# EAGLE design Sensirion_connector_board_v002 (EAGLE 9.6.2)
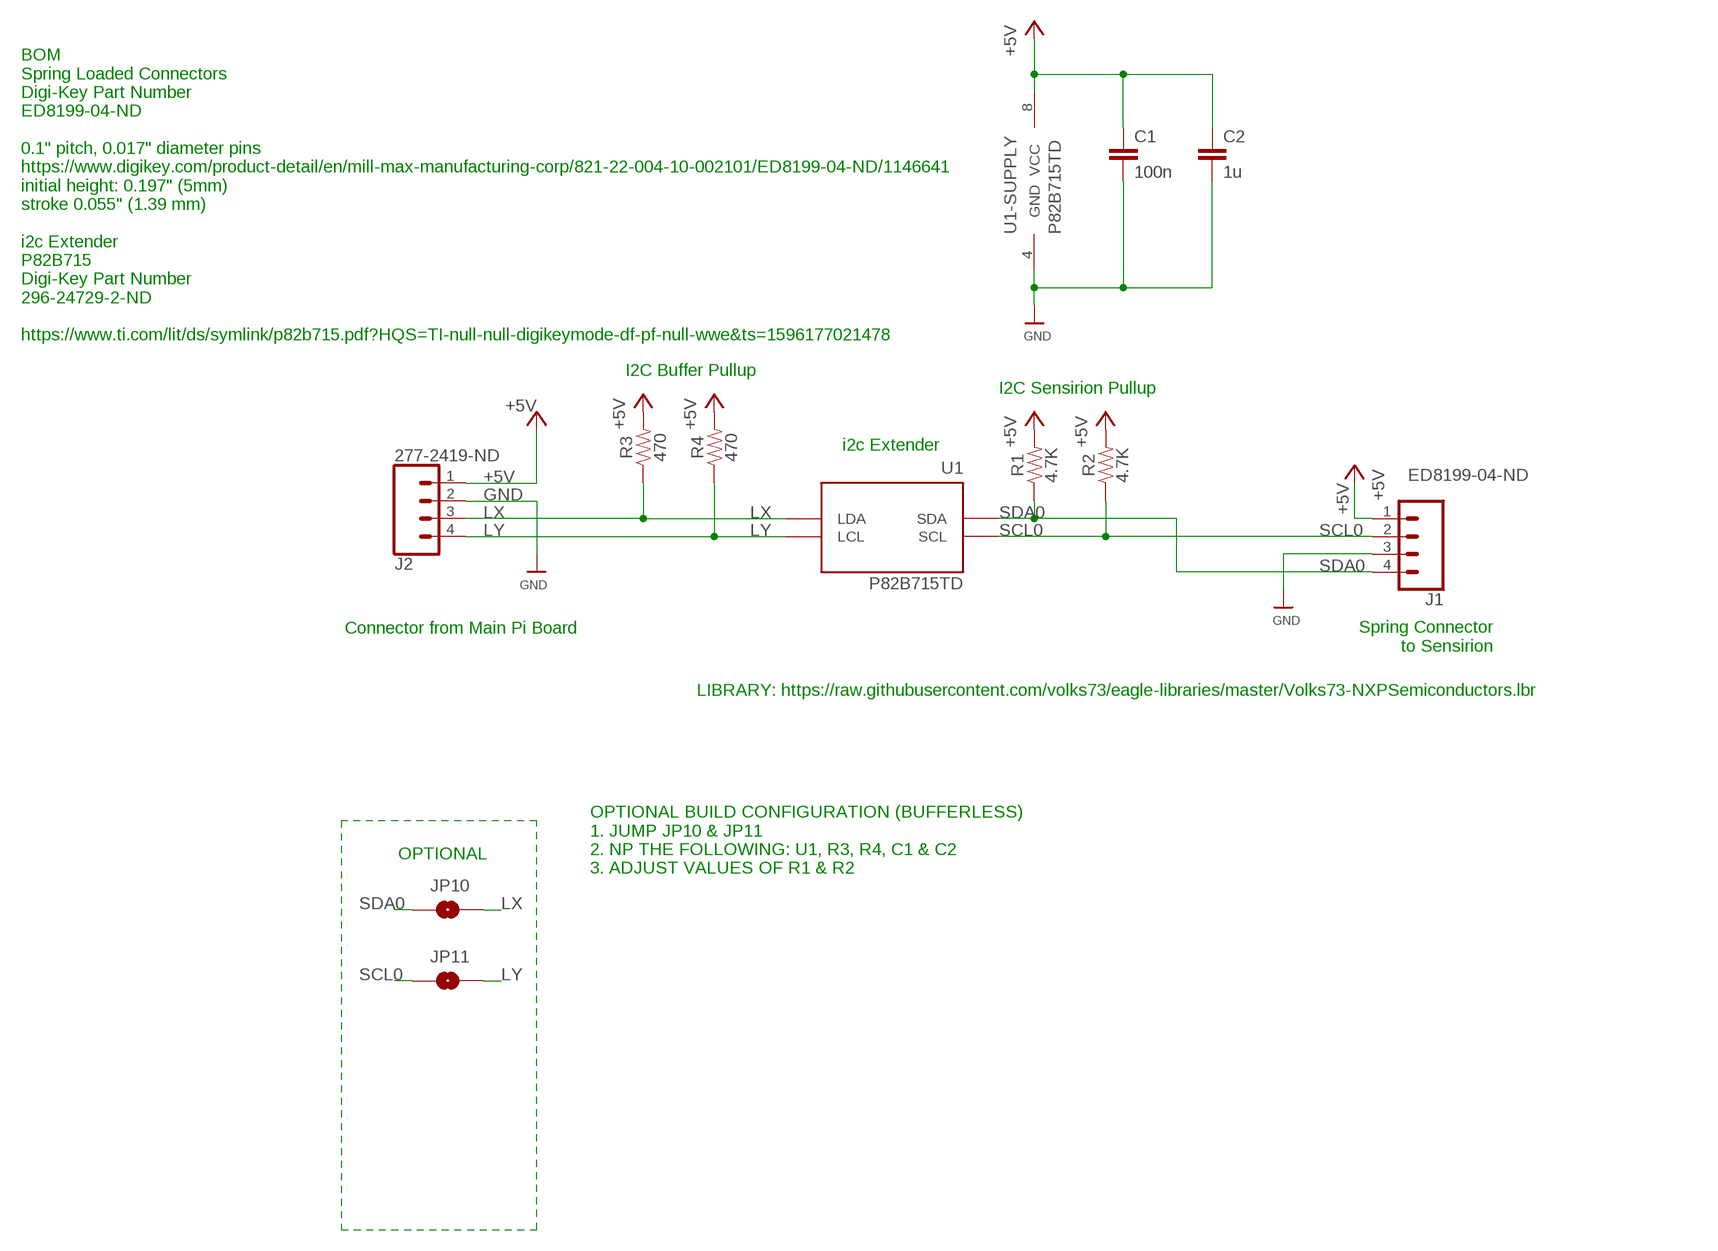
[diagram p0: schematic, sheet 1]

## Parts
C1  100n  CAP-0805  [0805]
C2  1u  CAP-0805  [0805]
J1  ED8199-04-ND  CONN_0430MILL_DIA  [1X04_30MILL_DIA]
J2  277-2419-ND  CONN_043.5MM_RA  [1X04_3.5MM_RA]
JP10  JUMPER-SMT_2_NO_SILK  [SMT-JUMPER_2_NO_SILK]
JP11  JUMPER-SMT_2_NO_SILK  [SMT-JUMPER_2_NO_SILK]
R1  4.7K  0.3OHM-0805-1/8W-1%  [0805]
R2  4.7K  0.3OHM-0805-1/8W-1%  [0805]
R3  470  0.3OHM-0805-1/8W-1%  [0805]
R4  470  0.3OHM-0805-1/8W-1%  [0805]
U1  P82B715TD  [SOIC-8]

## Nets
+5V: C1.1 C2.1 J1.1 J2.1 R1.2 R2.2 R3.2 R4.2 U1.8(VCC)
GND: C1.2 C2.2 J1.3 J2.2 U1.4(GND)
LX: J2.3 JP10.2 R3.1 U1.7(LDA)
LY: J2.4 JP11.2 R4.1 U1.2(LCL)
SCL0: J1.2 JP11.1 R2.1 U1.3(SCL)
SDA0: J1.4 JP10.1 R1.1 U1.6(SDA)

## Notes on the sheet
- BOM
  Spring Loaded Connectors 
  Digi-Key Part Number
  ED8199-04-ND
  
  0.1" pitch, 0.017" diameter pins
  https://www.digikey.com/product-detail/en/mill-max-manufacturing-corp/821-22-004-10-002101/ED8199-04-ND/1146641
  initial height: 0.197" (5mm)
  stroke 0.055" (1.39 mm)
  
  i2c Extender
  P82B715 
  Digi-Key Part Number
  296-24729-2-ND
  
  https://www.ti.com/lit/ds/symlink/p82b715.pdf?HQS=TI-null-null-digikeymode-df-pf-null-wwe&ts=1596177021478
- I2C Buffer Pullup
- I2C Sensirion Pullup
- i2c Extender
- Connector from Main Pi Board
- Spring Connector
  to Sensirion
- LIBRARY: https://raw.githubusercontent.com/volks73/eagle-libraries/master/Volks73-NXPSemiconductors.lbr
- OPTIONAL
- OPTIONAL BUILD CONFIGURATION (BUFFERLESS)
  1. JUMP JP10 & JP11
  2. NP THE FOLLOWING: U1, R3, R4, C1 & C2
  3. ADJUST VALUES OF R1 & R2

## Library data of the parts
C1 C2 = SparkFun-Capacitors:CAP
J1 J2 = th_libraries:CONN_04: Multi connection point. Often used as Generic Header-pin footprint for 0.1 inch spaced/style header connections On any of the 0.1 inch spaced packages, you can populate with these: Break Away Headers - Straight <https://www.sparkfun.com/products/116> (PRT-00116) Break Away Male Headers - Right Angle <https://www.sparkfun.com/products/553> (PRT-00553) Female Headers <https://www.sparkfun.com/products/115> (PRT-00115) Break Away Headers - Machine Pin <https://www.sparkfun.com/products/117> (PRT-00117) Break Away Female Headers - Swiss Machine Pin <https://www.sparkfun.com/products/743> (PRT-00743) For SCREWTERMINALS and SPRING TERMINALS visit here: Screw Terimnals on SparkFun.com <https://www.sparkfun.com/search/results?term=Screw+Terminals> (5mm/3.5mm/2.54mm spacing) This device is also useful as a general connection point to wire up your design to another part of your project. Our various solder wires solder well into these plated through hole pads. Hook-Up Wire - Assortment (Stranded, 22 AWG) <https://www.sparkfun.com/products/11375> (PRT-11375) Hook-Up Wire - Assortment (Solid Core, 22 AWG) <https://www.sparkfun.com/products/11367> (PRT-11367) View the entire wire category on our website here <https://www.sparkfun.com/categories/141> Special notes: Molex polarized connector foot print use with SKU : PRT-08231 with associated crimp pins and housings. 1MM SMD Version SKU: PRT-10208
JP10 JP11 = SparkFun-Jumpers:JUMPER-SMT_2_NO: Normally open jumper This jumper has two pads in close proximity to each other. Apply solder to close the connection. Round pads are easier to solder for beginners, but are a lot larger. SparkFun Product that uses the round pads: SparkFun EL Sequencer <https://www.sparkfun.com/products/12781>
R1-R4 = SparkFun-Resistors:0.3OHM: 0.3Ω resistor A resistor is a passive two-terminal electrical component that implements electrical resistance as a circuit element. Resistors act to reduce current flow, and, at the same time, act to lower voltage levels within circuits. - Wikipedia; PROD_ID: RES-11622; VALUE: 0.3
U1 = Volks73-NXPSemiconductors:P82B715?: I2C-Bus Extender I2C-bus extender Documentation Datasheet <http://www.nxp.com/documents/data_sheet/P82B715.pdf> General Description The P82B715 is a bipolar IC intended for application in I2C-bus and derivative bus systems. While retaining all the operating modes and features of the I2C-bus it permits extension of the practical separation distance between components on the I2C-bus by buffering both the data (SDA) and the clock (SCL) lines. The I2C-bus capacitance limit of 400 pF restricts practical communication distances to a few meters. Using one P82B715 at each end of a long cable (connecting Lx/Ly to Lx/Ly) reduces that cable’s loading on the linked I2C-buses by a factor of 10 and allows the total system capacitance load (all devices, cable, connectors, and traces or wires connected to the I2C-bus) to be around 3000 pF while the loading on each I2C-bus on the Sx/Sy sides remains below 400 pF. Longer cables or low-cost, general-purpose wiring may be used to link I2C-bus based modules without degrading noise margins. Multiple P82B715s can be connected together, linking their Lx/Ly ports, in a star or multi-point architecture as long as the total capacitance of the system is less than about 3000 pF and each bus at an Sx/Sy connection is well below 400 pF. This configuration, with the master and/or slave devices attached to the Sx/Sy port of each P82B715, has full multi-master communication capability. The P82B715 alone does not support voltage level translation, but it can be simply implemented using low cost transistors when required. There is no restriction on interconnecting the Sx/Sy I/Os, and, because the device output levels are always held within 100 mV of input drive levels, P82B715 is compatible with bus buffers that use voltage level offsets, e.g., PCA9511A, PCA9517, Sx/Sy side of P82B96. The lower VOL level and ability to operate with any master, slave or bus buffer is the primary advantage of the using the P82B715 for long distance buses at the disadvantage of not isolating bus capacitance like the P82B96 or PCA9600 are able to do. The primary disadvantage of the P82B96 and PCA9600 is that the static level offset needed to isolate bus capacitance does not allow these devices to operate with other bus buffers with special offset levels or with master/slaves that require a VIL lower than 0.8 V with noise margin. A proven quick design-in point-to-point/multi-point circuit (Figure 9) is included in Section 8.2 to allow rapid use of the P82B715 along with comparison waveforms so that the designer can clearly see the trade-offs between the P82B715 and the P82B96/PCA9600 and choose the type of device that is best for their application. Features Dual, bidirectional, unity voltage gain buffer with no external directional control required Compatible with I2C-bus and its derivatives SMBus, PMBus, DDC, etc. Logic signal levels may include (but not exceed) both supply and ground Logic signal input voltage levels are output without change and are independent of VCC ×10 impedance transformation, but does not change logic voltage levels Supply voltage range 3 V to 12 V Clock speeds to at least 100 kHz and 400 kHz when other system delays permit ESD protection exceeds 2500 V HBM per Mil. Std 883C-3015.7 and 400 V MM per JESD22-A115 (I/Os have diodes to VCC and GND) Latch-up testing is done to JEDEC Standard JESD78 which exceeds 100 mA Applications Increase the total connected capacitance of an I2C-bus system to around 3000 pF Drive I2C-bus signals over long cables to approximately 50 meters or 3000 pF Drives ×10 lower impedance bus wiring for improved noise immunity Multi-drop distribution of I2C-bus signals using low cost twisted-pair cables AdvancedTCA radial IPMB architecture Driving 30 mA Fm+ devices from standard 3 mA parts; APPLICATIONS: I2C; CAPACITANCE-INPUT: 3000pF; CURRENT_SUPPLY: 22mA; DATA_RATE: 400kHz; DELAY_TIME: -; DESCRIPTION: IC REDRIVER I2C 1CH 400KHZ 8SO; DOCUMENTATION_LINK: <a href="http://www.nxp.com/documents/data_sheet/P82B715.pdf">Datasheet</a>; DOCUMENTATION_URL: http://www.nxp.com/documents/data_sheet/P82B715.pdf; INPUT: 2-Wire Buse; MANUFACTURER: NXP Semiconductors; NUMBER_OF_CHANNELS: 1; OPERATING_TEMPERATURE: -40C ~ 85C; OUTPUT: 2-Wire Bus; PART_NUMBER: P82B715TD,118; SIGNAL_CONDITIONING: -; SUPPLIER_ITEM_LINK: <a href="http://www.digikey.com/product-detail/en/P82B715TD,118/568-1007-2-ND/735621">Details</a>; SUPPLIER_ITEM_NUMBER: 568-1007-2-ND; SUPPLIER_ITEM_URL: http://www.digikey.com/product-detail/en/P82B715TD,118/568-1007-2-ND/735621; SUPPLIER_LINK: <a href="http://www.digikey.com">Home Page</a>; SUPPLIER_NAME: Digi-Key; SUPPLIER_URL: http://www.digikey.com; TYPE: Buffer, ReDriver; VOLTAGE_SUPPLY: 4.5V ~ 12V

## Board
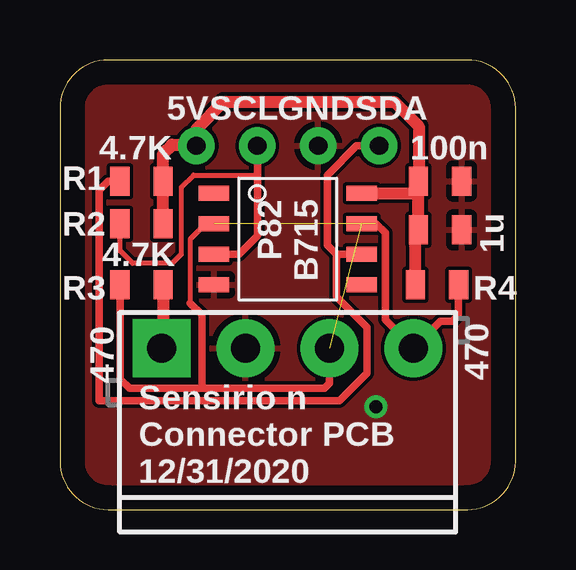
[diagram p1: board, top side]
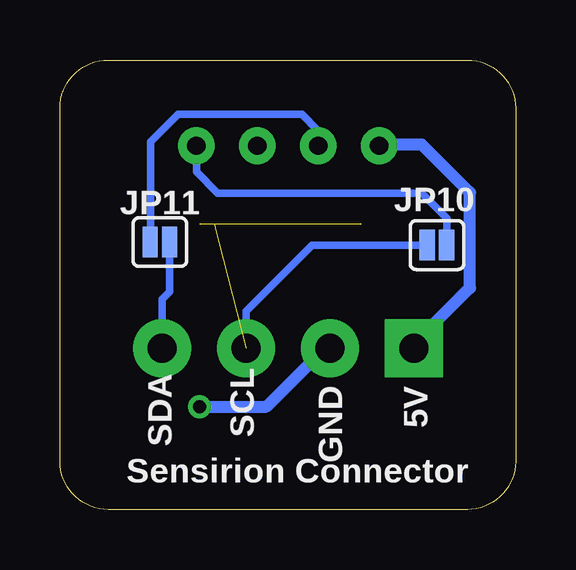
[diagram p2: board, bottom side, seen from below]

Size 19 x 18.73 mm. Coordinates in mm from the lower left corner, seen from the top.
Outline: 17,0 arc90 19,2 19,16.73 arc90 17,18.73 2,18.73 arc90 0,16.73 0,2 arc90 2,0 17,0
Copper layers (1*16): Top 0.035mm / dielectric 1.5mm / Bottom 0.035mm
Design rules "JLCPCB 2 Layer TETRA": minimum track width 6mil, minimum drill 0.35mm, track to track 6mil, track to pad 6mil, pad to pad 6mil, via to via 6mil, smd to smd 6mil, copper to edge 40mil, drill to drill 6mil, minimum pad ring 10mil, minimum via ring 8mil, stop-mask expansion 4mil, vias tented up to drill 0mil, thermal gap 10mil

### Footprints (pad centres in the part's own frame; a part is rotated, then mirrored left to right if it is on the bottom)
0805 = smd 0.8 x 1.2: 1 -0.9,0; 2 0.9,0
1X04_30MILL_DIA = drill 0.762 pad 1.524: 1 0,0; 2 2.54,0; 3 5.08,0; 4 7.62,0
1X04_3.5MM_RA = drill 1.2 pad 2.413 square: 1 -0.228,0.023 | drill 1.2 pad 2.413: 2 3.272,0.023; 3 6.772,0.023; 4 10.272,0.023
SMT-JUMPER_2_NO_SILK = smd 0.635 x 1.27: 1 -0.406,0; 2 0.406,0
SOIC-8 = smd 1.27 x 0.635: 1 -3.073,1.905; 2 -3.073,0.635; 3 -3.073,-0.635; 4 -3.073,-1.905; 5 3.073,-1.905; 6 3.073,-0.635; 7 3.073,0.635; 8 3.073,1.905

### Placement (x,y rotation side)
C1  15.85,13.68 0 top
C2  15.85,11.65 0 top
J1  5.69,15.16 0 top
J2  4.47,6.7 0 top
JP10  3.28,11.02 180 bottom
JP11  14.83,11.14 0 bottom
R1  3.4,13.68 0 top
R2  3.4,11.9 0 top
R3  3.4,9.37 0 top
R4  15.72,9.37 180 top
U1  9.5,11.27 0 top

### Tracks (layer width: path | path; a pad name or v marks a point on that pad's centre or on a via)
+5V
  Top 0.508: R4.2 14.82,11.52 C2.1 14.95,13.18 | 14.95,13.18 C1.1 14.96,13.69 14.96,15.97 13.94,16.99 6.83,16.99 5.69,15.84 J1.1 5.64,15.21 4.67,15.21 4.3,14.84 R1.2 R2.2 | U1.8 14.95,13.18 | R3.2 4.3,6.78 J2.1
  Bottom 0.508: J2.1 4.24,6.9 1.91,9.24 1.91,13.2 3.91,15.21 5.64,15.21 J1.1
GND  (via drill 0.55)
  Bottom 0.508: v13.18,4.28 10.39,4.28 7.95,6.72 J2.2
  pour Top: -0.66,18.89 19.66,18.89 19.66,-1.43 -0.66,-1.43
LX  (1 unrouted)
  Top 0.203: 5.94,11.78 5.44,11.27 5.44,8.6
  Top 0.305: J2.3 11.24,5.27 11.02,5.05 5.93,5.05 | 5.93,5.05 2.9,5.05 2.51,5.43 2.51,9.35 R3.1 | 6.3,11.78 5.94,11.78 | 5.44,8.6 5.93,8.11 5.93,5.05
  Bottom 0.305: JP10.2 8.48,11.02 11.24,8.26 J2.3
LY  (1 unrouted)
  Top 0.305: R4.1 16.61,9.35 16.61,8.09 16.36,7.84 15.86,7.84 J2.4 13.56,7.9 13.56,11.52 13.18,11.9
  Bottom 0.305: JP11.2 14.43,9.07 14.74,8.75 J2.4
SCL0
  Top 0.203: 8.23,13.94 5.56,13.94 5.06,13.43 5.06,10.63 4.67,10.25 3.02,10.25 2.5,10.77 R2.1
  Top 0.305: J1.2 8.23,13.94 8.23,11.4 7.47,10.63 U1.3
  Bottom 0.305: J1.2 8.23,15.79 8.92,16.48 14.07,16.48 15.21,15.33 15.21,11.17 JP11.1
SDA0
  Top 0.305: 11.53,10.63 11.15,11.02 11.15,13.94 12.37,15.16 J1.4 | U1.6 11.53,10.63 | 11.53,10.63 11.53,8.86 12.8,7.59 12.8,5.68 11.66,4.54 1.63,4.54 1.63,13.3 2.01,13.68 R1.1
  Bottom 0.305: JP10.1 2.87,12.13 3.91,13.18 12.42,13.18 13.31,14.06 J1.4

### Text on the board
tPlace: 5V | SCL | GND | SDA | P82 / B715 | Sensirio n / Connector PCB / 12/31/2020
bPlace: GND | 5V | SCL | SDA | Sensirion Connector